# EAGLE design Flasher_LED_Board (EAGLE 9.6.0)
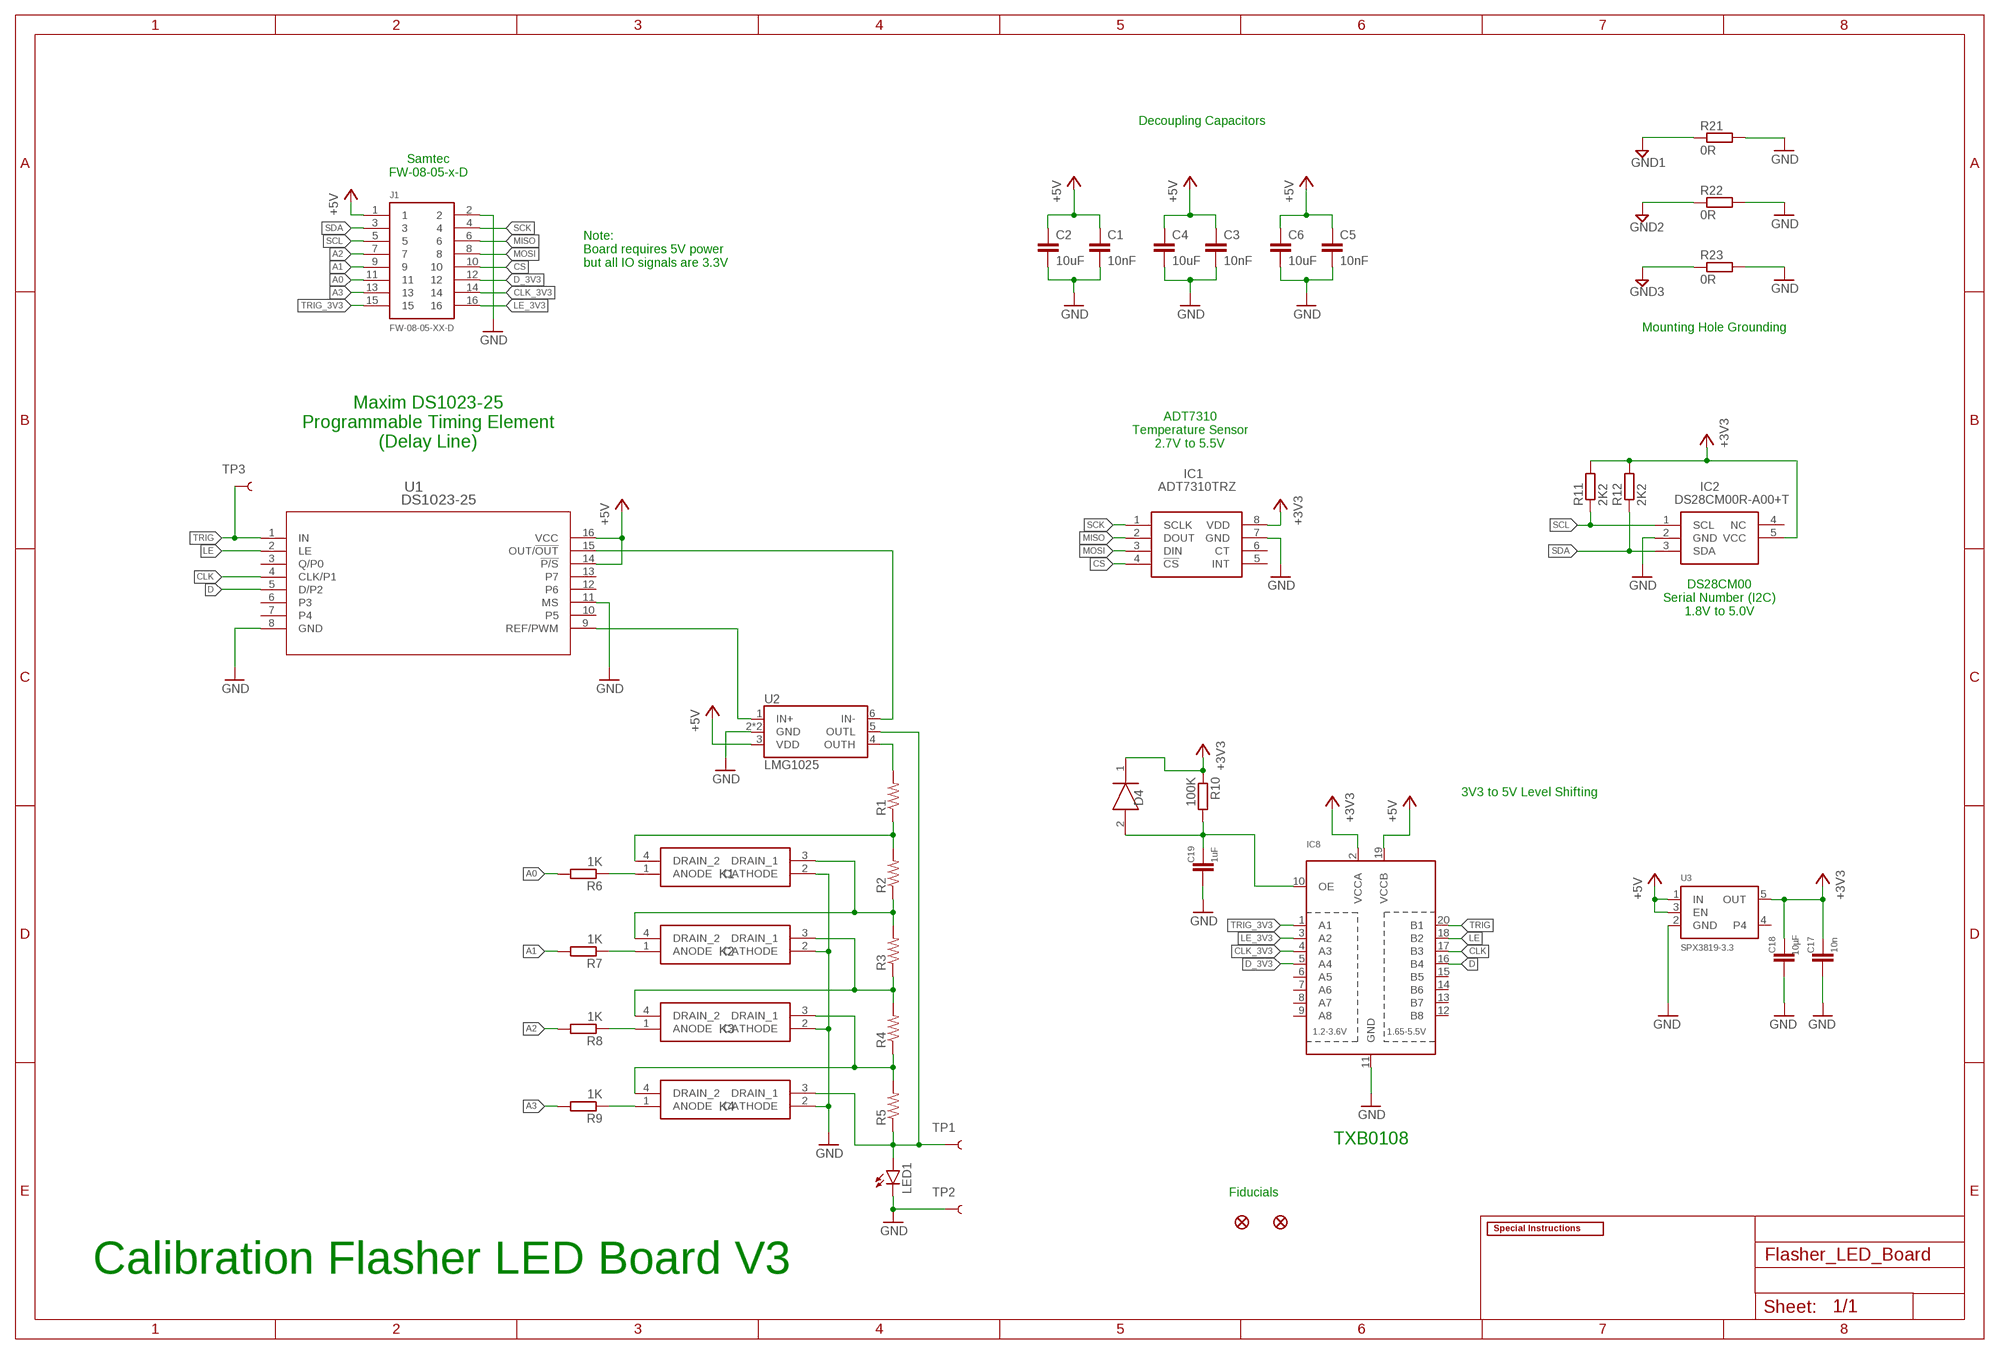
[diagram p0: schematic, sheet 1]

## Parts
C1  10nF  C-EUC0805  [C0805]
C2  10uF  C-EUC0805  [C0805]
C3  10nF  C-EUC0805  [C0805]
C4  10uF  C-EUC0805  [C0805]
C5  10nF  C-EUC0805  [C0805]
C6  10uF  C-EUC0805  [C0805]
C17  10n  C-EUC0603  [C0603]
C18  10µF  C-EUC0805  [C0805]
C19  1uF  C-EUC0603  [C0603]
D4  CD0603-B00340  [DIOM179X85N]
FD1  FIDUCIAL1X2  [FIDUCIAL-1X2]
FD2  FIDUCIAL1X2  [FIDUCIAL-1X2]
IC1  ADT7310TRZ  [SOIC127P600X175-8N]
IC2  DS28CM00R-A00+T  [SOT95P280X145-5N]
IC8  TXB0108PWR  [TSSOP20]
J1  FW-08-05-XX-D  [FW-08-05-XX-D]
K1  TLP3475R(TP,F  [TLP3475RTPF]
K2  TLP3475R(TP,F  [TLP3475RTPF]
K3  TLP3475R(TP,F  [TLP3475RTPF]
K4  TLP3475R(TP,F  [TLP3475RTPF]
LED1  LED3MM  [LED3MM]
LOGO6  SPECIAL_INSTRUCTIONS-ORDERING  [ORDERING_INSTRUCTIONS]
R1  RESISTOR0805-RES  [0805]
R2  RESISTOR0805-RES  [0805]
R3  RESISTOR0805-RES  [0805]
R4  RESISTOR0805-RES  [0805]
R5  RESISTOR0805-RES  [0805]
R6  1K  R-EU_R0603  [R0603]
R7  1K  R-EU_R0603  [R0603]
R8  1K  R-EU_R0603  [R0603]
R9  1K  R-EU_R0603  [R0603]
R10  100K  R-EU_R0603  [R0603]
R11  2K2  R-EU_R0603  [R0603]
R12  2K2  R-EU_R0603  [R0603]
R21  0R  R-EU_R0603  [R0603]
R22  0R  R-EU_R0603  [R0603]
R23  0R  R-EU_R0603  [R0603]
TP1  TEST-POINTPOGO_PTH  [1X01_NO_SILK]
TP2  TEST-POINTPOGO_PTH  [1X01_NO_SILK]
TP3  TEST-POINTPOGO_PTH  [1X01_NO_SILK]
U1  DS1023-25  [21-0042B_16]
U2  LMG1025  [LMG1025]
U3  SPX3819-3.3  VREG_SOT23-5  [SOT23-5]

## Nets
+3V3: C17.1 C18.1 D4.1(K) IC1.8(VDD) IC2.5(VCC) IC8.2(VCCA) R10.1 R11.2 R12.2 U3.5(OUT)
+5V: C1.1 C2.1 C3.1 C4.1 C5.1 C6.1 IC8.19(VCCB) J1.1 U1.14(!P/S) U1.16(VCC) U2.3(VDD) U3.1(IN) U3.3(EN)
A0: J1.11 R6.2
A1: J1.9 R7.2
A2: J1.7 R8.2
A3: J1.13 R9.2
CLK: IC8.17(B3) U1.4(CLK/P1)
CLK_3V3: IC8.4(A3) J1.14
CS: IC1.4(!CS) J1.10
D: IC8.16(B4) U1.5(D/P2)
D_3V3: IC8.5(A4) J1.12
GND: C1.2 C2.2 C3.2 C4.2 C5.2 C6.2 C17.2 C18.2 C19.2 IC1.7(GND) IC2.2(GND) IC8.11(GND) J1.2 K1.2(CATHODE) K2.2(CATHODE) K3.2(CATHODE) K4.2(CATHODE) LED1.K(C) R21.2 R22.2 R23.2 TP2.1 U1.8(GND) U1.11(MS) U2.2(GND) U2.PAD(GND) U3.2(GND)
GND1: R21.1
GND2: R22.1
GND3: R23.1
LE: IC8.18(B2) U1.2(LE)
LE_3V3: IC8.3(A2) J1.16
MISO: IC1.2(DOUT) J1.6
MOSI: IC1.3(DIN) J1.8
N$9: C19.1 D4.2(A) IC8.10(OE) R10.2
N$33: U1.15(OUT/!OUT) U2.6(IN-)
N$34: U1.9(REF/PWM) U2.1(IN+)
N$35: R1.2 U2.4(OUTH)
N$36: K1.4(DRAIN_2) R1.1 R2.2
N$37: K1.3(DRAIN_1) K2.4(DRAIN_2) R2.1 R3.2
N$38: K2.3(DRAIN_1) K3.4(DRAIN_2) R3.1 R4.2
N$39: K3.3(DRAIN_1) K4.4(DRAIN_2) R4.1 R5.2
N$40: K4.3(DRAIN_1) LED1.A R5.1 TP1.1 U2.5(OUTL)
N$41: K1.1(ANODE) R6.1
N$42: K2.1(ANODE) R7.1
N$43: K3.1(ANODE) R8.1
N$44: K4.1(ANODE) R9.1
SCK: IC1.1(SCLK) J1.4
SCL: IC2.1(SCL) J1.5 R11.1
SDA: IC2.3(SDA) J1.3 R12.1
TRIG: IC8.20(B1) TP3.1 U1.1(IN)
TRIG_3V3: IC8.1(A1) J1.15
Unconnected: IC1.5(INT) IC1.6(CT) IC2.4(NC) IC8.6(A5) IC8.7(A6) IC8.8(A7) IC8.9(A8) IC8.12(B8) IC8.13(B7) IC8.14(B6) IC8.15(B5) U1.3(Q/P0) U1.6(P3) U1.7(P4) U1.10(P5) U1.12(P6) U1.13(P7) U3.4

## Notes on the sheet
- Decoupling Capacitors
- Samtec
  FW-08-05-x-D
- Note:
  Board requires 5V power
  but all IO signals are 3.3V
- Mounting Hole Grounding
- Maxim DS1023-25
  Programmable Timing Element
  (Delay Line)
- ADT7310
  Temperature Sensor
  2.7V to 5.5V
- DS28CM00
  Serial Number (I2C)
  1.8V to 5.0V
- 3V3 to 5V Level Shifting
- TXB0108
- Fiducials
- Calibration Flasher LED Board V3

## Library data of the parts
C1-C6 C17-C19 = rcl:C-EU: CAPACITOR, European symbol; SPICEPREFIX: C
D4 = SamacSys_Parts:CD0603-B00340: Diode Schottky Signal 45V 30mA 0603 Bourns CD0603-B00340, SMT Schottky Diode, 45V 30mA, 2-Pin 0603 Source: Datasheet <https://www.arrow.com/en/products/cd0603-b00340/bourns>; ARROW_PART_NUMBER: CD0603-B00340; DESCRIPTION: Diode Schottky Signal 45V 30mA 0603 Bourns CD0603-B00340, SMT Schottky Diode, 45V 30mA, 2-Pin 0603; HEIGHT: 0.85mm; MANUFACTURER_NAME: Bourns; MANUFACTURER_PART_NUMBER: CD0603-B00340
FD1 FD2 = SparkFun-Aesthetics:FIDUCIAL: Fiducial Alignment Points Various fiducial points for machine vision alignment.
IC1 = SamacSys_Parts:ADT7310TRZ: ADT7310TRZ, 16 bit Temperature Sensor 0.5C Serial-SPI 2.7 3.6 V 8-Pin SOIC Source: Datasheet <http://docs-emea.rs-online.com/webdocs/12a1/0900766b812a177b.pdf>; ARROW_PART_NUMBER: ADT7310TRZ; ARROW_PRICE-STOCK: https://www.arrow.com/en/products/adt7310trz/analog-devices; DESCRIPTION: ADT7310TRZ, 16 bit Temperature Sensor 0.5C Serial-SPI 2.7 3.6 V 8-Pin SOIC; HEIGHT: 1.75mm; MANUFACTURER_NAME: Analog Devices; MANUFACTURER_PART_NUMBER: ADT7310TRZ; RS_PART_NUMBER: 7969022P; RS_PRICE-STOCK: http://uk.rs-online.com/web/p/products/7969022P
IC2 = SamacSys_Parts:DS28CM00R-A00+T: Maxim DS28CM00R-A00+T, Silicon Serial Number 48bit Surface Mount, 1.62 5.25 V, 5-Pin SOT-23 Source: Datasheet <https://componentsearchengine.com/Datasheets/1/DS28CM00R-A00 T.pdf>; DESCRIPTION: Maxim DS28CM00R-A00+T, Silicon Serial Number 48bit Surface Mount, 1.62 5.25 V, 5-Pin SOT-23; HEIGHT: 1.45mm; MANUFACTURER_NAME: Maxim Integrated; MANUFACTURER_PART_NUMBER: DS28CM00R-A00+T; MOUSER_PART_NUMBER: 700-DS28CM00R-A00T
IC8 = adafruit:TXB0108PWR: 8-Bit Bi-Directional Level Shifter 1.2V-3.6V (VCCA) to 1.65V-5.5V (VCCB) bi-directional level shifter with auto direction sensing. Max data rate - VCCA 1.8V: 20Mbps (50ns), VCCA 3.3V: 100Mbps (10ns) Digikey: 296-21527-1-ND
J1 = FW-08-05-XX-D:FW-08-05-XX-D: .050 x .050 SURFACE MOUNT BOARD SPACERS.
K1-K4 = SamacSys_Parts:TLP3475R(TP,F: Solid State Relays - PCB Mount Photo-IC 3mA 50V 5000Vrms Source: Datasheet <http://toshiba.semicon-storage.com/info/docget.jsp?did=55304&prodName=TLP3475R>; DESCRIPTION: Solid State Relays - PCB Mount Photo-IC 3mA 50V 5000Vrms; HEIGHT: 1mm; MANUFACTURER_NAME: Toshiba; MANUFACTURER_PART_NUMBER: TLP3475R(TP,F; MOUSER_PART_NUMBER: 757-TLP3475RTPF; MOUSER_PRICE-STOCK: https://www.mouser.com/Search/Refine.aspx?Keyword=757-TLP3475RTPF
LED1 = SparkFun-LED:LED: LEDs Standard schematic elements and footprints for 5mm, 3mm, 1206, and 0603 sized LEDs. 5mm - Spark Fun Electronics SKU : COM-00529 (and others); PROD_ID: DIO-08794
LOGO6 = SparkFun-Aesthetics:SPECIAL_INSTRUCTIONS: Special Ordering/Production Instructions Alert Symbol for special PCB ordering instructions or unique production process warnings. Ordering Instructions Production Instructions Types of information that should be added to box: Copper weight Soldermask color Silk color PCB thickness Number of layers PCB Standard: 1.6mm FR4 1 oz copper immersion silver plating red soldermask white silkscreen Types of information that should be added to box: Special wash requirements Depaneling instructions Humidification Glue curing Default text settings: 0.07 inch 9% ratio 50% line distance
R1-R5 = SparkFun-Resistors:RESISTOR: Resistor Basic schematic elements and footprints for 0603, 1206, and PTH resistors.
R6-R9 = resistor:R-EU_: RESISTOR, European symbol
R10-R12 R21-R23 = rcl:R-EU_: RESISTOR, European symbol; SPICEPREFIX: R
TP1-TP3 = SparkFun-Connectors:TEST-POINT: SparkFun Test Points Bare copper test points for troubleshooting or In-Circuit-Testing. These are used by our Production team for verifying production board runs using pogo-pins on test beds. SparkFun Products: SparkFun LSM9DS1 Breakout <https://www.sparkfun.com/products/13284> SparkFun PSOC <https://www.sparkfun.com/products/13714> SparkFun Load Cell Amplifier <https://www.sparkfun.com/products/13879>
U1 = DS1023:DS1023-25; MANUFACTURER_PART_NUMBER: DS102325; VENDOR: MAXIM
U2 = LMG1025:LMG1025: Texas Instruments LMG1025-Q1 Automotive Low Side GaN and MOSFET Driver For High Frequency and Narrow Pulse Applications
U3 = microbuilder:VREG_SOT23-5: SOT23-5 Fixed Voltage Regulators Part Current Out V Out V In V Dropout θJA (°C/W) TJ (°C) Digikey Part No. ADP121 150mA 3.3V 3.4-5.5V 0.09V @ 150mA -- -- ADP121-AUJZ33R7CT-ND ADP121 150mA 3.0V 3.1-5.5V 0.09V @ 150mA -- -- ADP121-AUJZ30R7CT-ND ADP122 300mA 3.3V 3.4-5.5V 0.085V @ 300mA -- -- ADP122AUJZ-3.3-R7CT-ND ADP1712 300mA 3.3V 3.5-5.5V 0.17V @ 300mA -- -- ADP1712AUJZ-3.3-R7TR-ND AP7311 (Low Cost) 150mA 3.3V 3.5-6V 0.15V @ 150mA -- -- AP7311-33WG-7DICT-ND LD39015M18R 150mA 1.8V 1.9V-5.5V 0.08V @ 100mA -- -- 497-6977-1-ND LP2985A-33DBVR 150mA 3.3V 3.3-16V 0.28V @ 150mA 206 150 296-18479-1-ND MCP1824T-3302E/OT 300mA 3.3V 3.5V-6V 0.2V @ 300mA -- -- MCP1824T-3302E/OTCT-ND MIC5205-2.5YM5 TR 150mA 2.5V 2.7-16V 0.165V @ 150mA -- -- 576-1257-2-ND MIC5205-3.0YM5 TR 150mA 3.0V 3.2V-16V 0.165V @ 150mA -- -- 576-1258-2-ND MIC5205-3.3YM5 TR 150mA 3.3V 3.5V-16V 0.165V @ 150mA -- -- 576-1259-2-ND TPS780330220 150mA 3.3V+2.2V 3.6-5.5V 250mV Max -- -- 296-23332-1-ND TDA3663/N1,135 100mA 3.3V 3.5-45V 0.18V @ 50mA -- -- 568-5343-1-ND Max operating temp can be calculated using θJA, TJ (max junction temperature), and power in watts. Set the "Maximum Ambient Temperature" until it reaches TJ ("Max Junction Temperature"), which is the absolute limit for safe use of the regulator: Heat Sink Temperature Calculator <http://www.daycounter.com/Calculators/Heat-Sink-Temperature-Calculator.phtml> For example, With 12V source into a 3.3V LP2985 and a 30mA load, we are dissipating (12V-3.3V) * 0.03A = 0.261W. With a θJA of 206 °C/W, a TJ of 150°C, and 261mW we can safely use the chip without a heat sink up to 75°C (=147.1°C Junction Temperature).

## Board
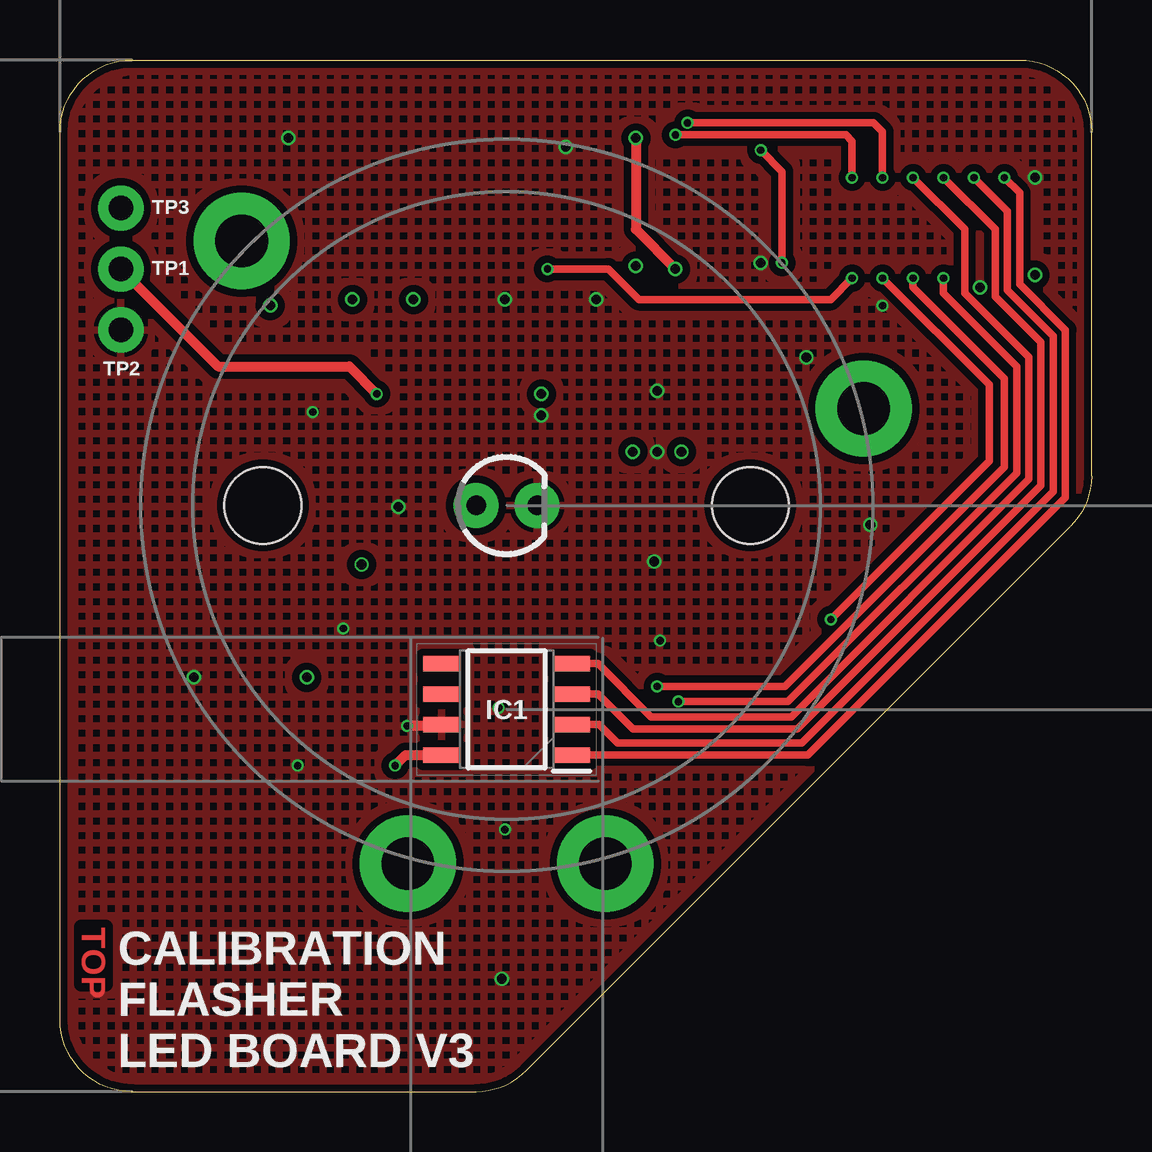
[diagram p1: board, top side]
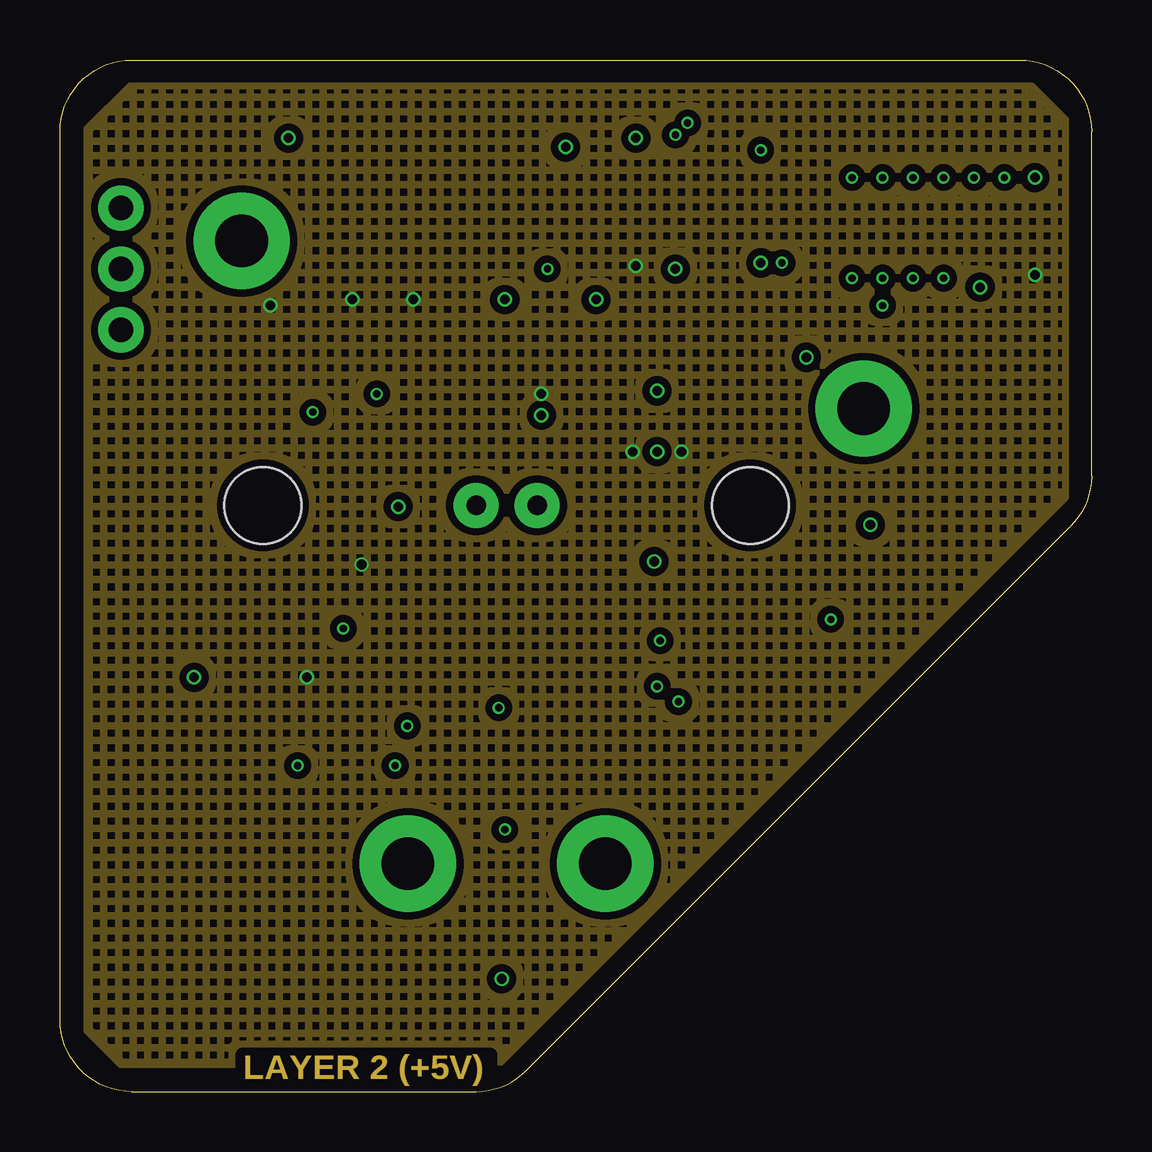
[diagram p2: board, inner layer Route2]
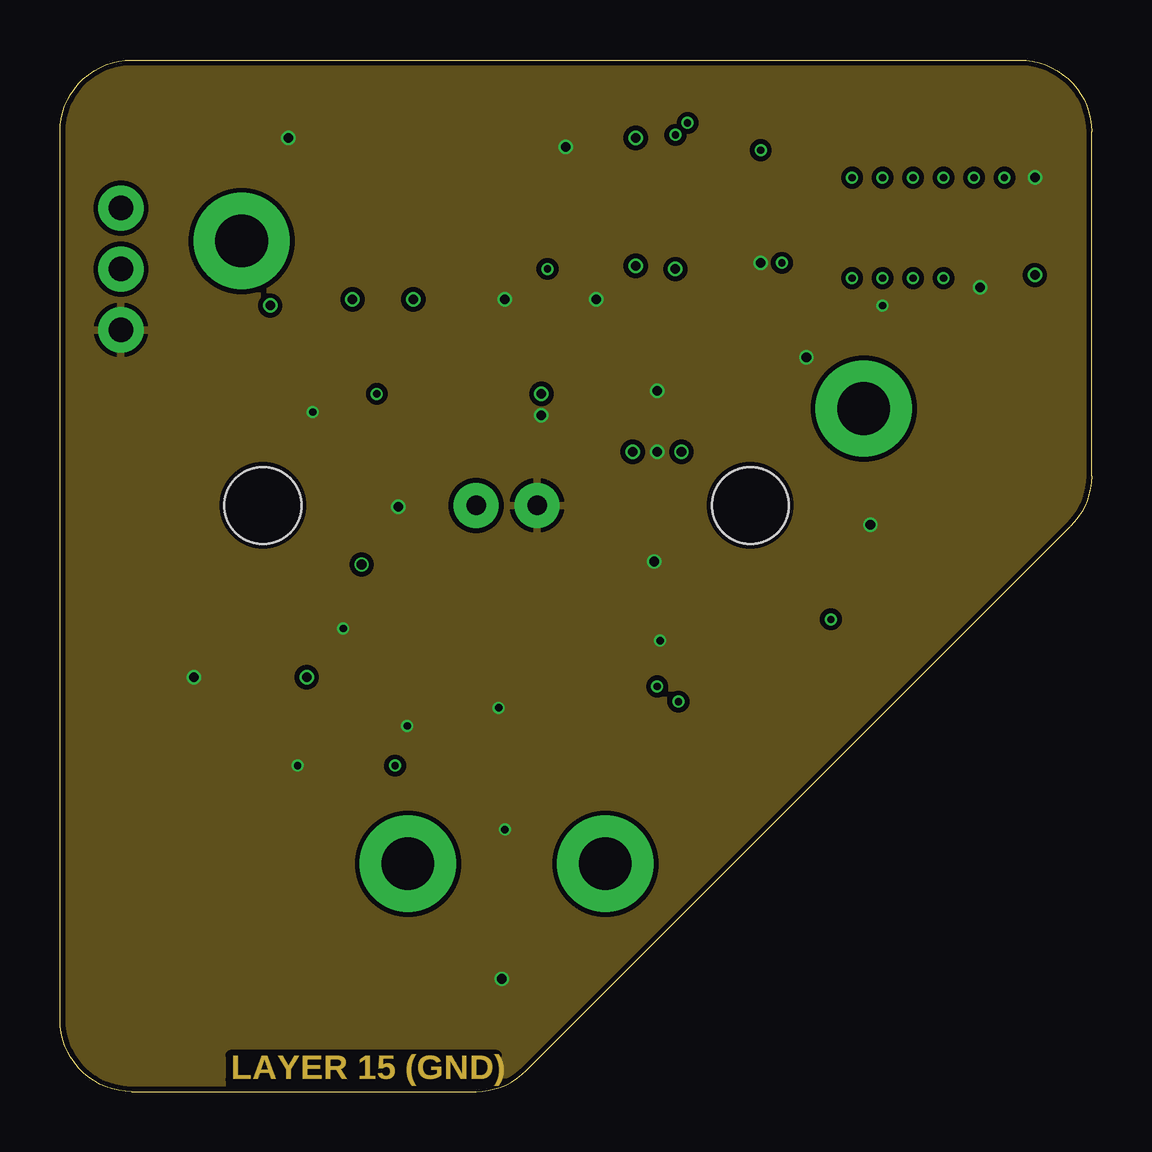
[diagram p3: board, inner layer Route15]
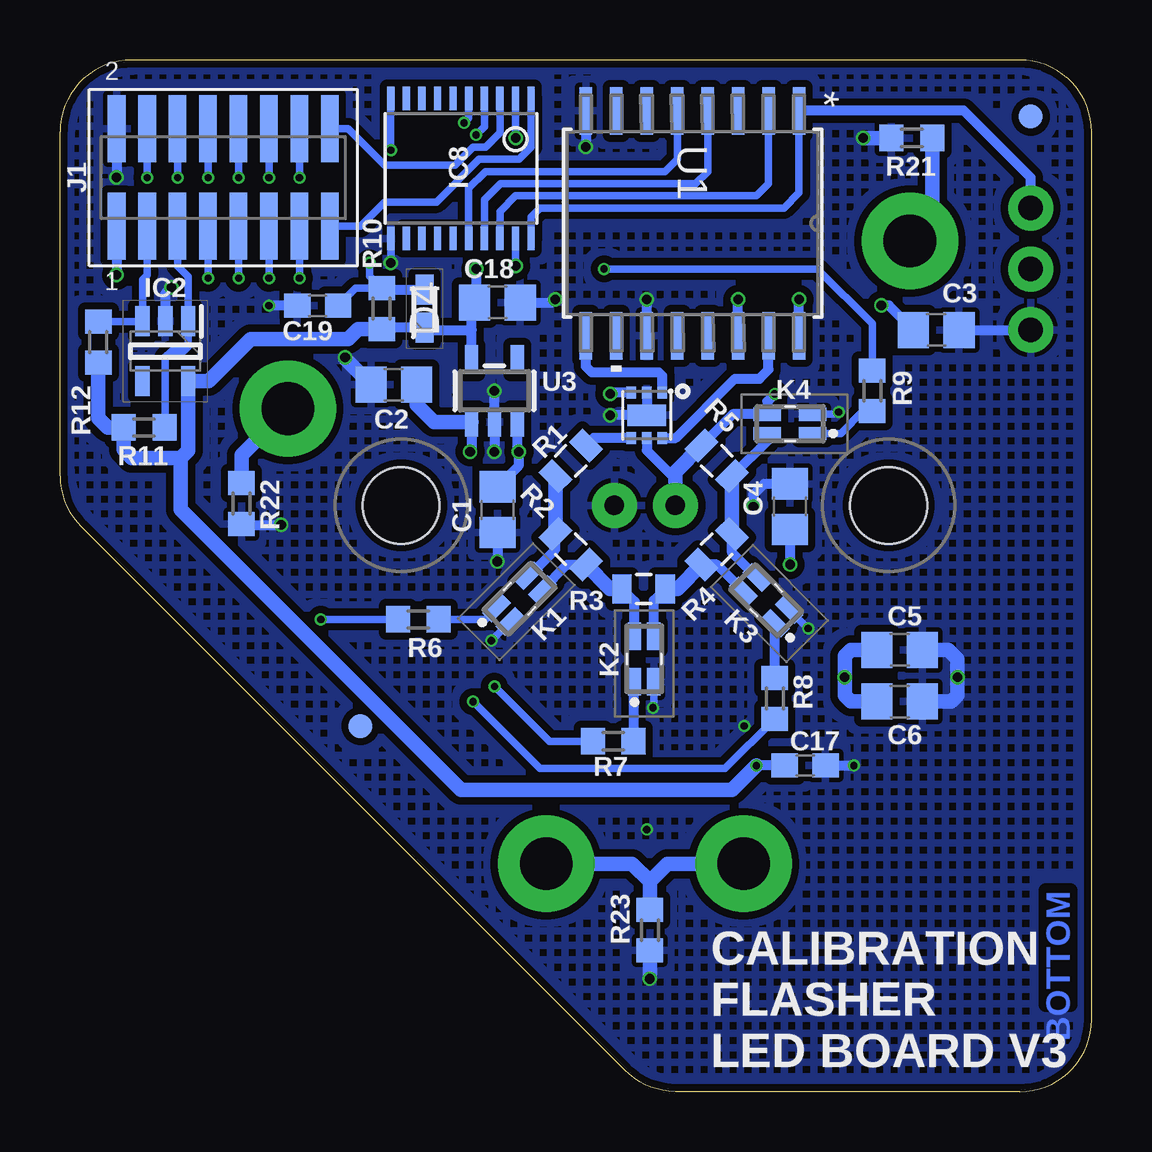
[diagram p4: board, bottom side, seen from below]

Size 43 x 43 mm. Coordinates in mm from the lower left corner, seen from the top.
Outline: 0,3 0,40.01 arc-90 3,43 40.01,43 arc-90 43,40.01 43,25.65 arc-45 42.11,23.55 19.46,0.89 arc-45 17.35,0 3,0 arc-90 0,3
Copper layers (1+2*15+16): Top 0.018mm / dielectric 0.36mm / Route2 0.035mm / dielectric 0.71mm / Route15 0.035mm / dielectric 0.2mm / Bottom 0.018mm
Design rules "Multi-CB_4L_100µm-Tracks_OL35µm-IL35µm *": minimum track width 0.1mm, minimum drill 0.2mm, track to track 0.1mm, track to pad 0.1mm, pad to pad 0.1mm, via to via 0.1mm, smd to smd 0mil, copper to edge 0.2mm, drill to drill 0.2mm, minimum pad ring 0.125mm, minimum via ring 0.1mm, stop-mask expansion 2mil, vias tented up to drill 0.45mm, thermal gap 0.2mm
Holes 3.2 mm at 8.46,24.43 28.78,24.43

### Footprints (pad centres in the part's own frame; a part is rotated, then mirrored left to right if it is on the bottom)
C0805 = smd 1.3 x 1.5: 1 -0.95,0; 2 0.95,0
C0603 = smd 1.1 x 1: 1 -0.85,0; 2 0.85,0
DIOM179X85N = smd 1.25 x 0.75: 1 -0.8,0; 2 0.8,0
FIDUCIAL-1X2 = smd 1 x 1: 1 0,0
SOIC127P600X175-8N = smd 1.525 x 0.65: 1 -2.712,1.905; 2 -2.712,0.635; 3 -2.712,-0.635; 4 -2.712,-1.905; 5 2.712,-1.905; 6 2.712,-0.635; 7 2.712,0.635; 8 2.712,1.905
SOT95P280X145-5N = smd 1.25 x 0.6: 1 -1.25,0.95; 2 -1.25,0; 3 -1.25,-0.95; 4 1.25,-0.95; 5 1.25,0.95
TSSOP20 = smd 0.305 x 0.991: 1 -2.925,-2.918; 2 -2.275,-2.918; 3 -1.625,-2.918; 4 -0.975,-2.918; 5 -0.325,-2.918; 6 0.325,-2.918; 7 0.975,-2.918; 8 1.625,-2.918; 9 2.275,-2.918; 10 2.925,-2.918; 11 2.925,2.918; 12 2.275,2.918; 13 1.625,2.918; 14 0.975,2.918; 15 0.325,2.918; 16 -0.325,2.918; 17 -0.975,2.918; 18 -1.625,2.918; 19 -2.275,2.918; 20 -2.925,2.918
FW-08-05-XX-D = smd 0.737 x 2.794: 1 -4.445,-2.032; 2 -4.445,2.032; 3 -3.175,-2.032; 4 -3.175,2.032; 5 -1.905,-2.032; 6 -1.905,2.032; 7 -0.635,-2.032; 8 -0.635,2.032; 9 0.635,-2.032; 10 0.635,2.032; 11 1.905,-2.032; 12 1.905,2.032; 13 3.175,-2.032; 14 3.175,2.032; 15 4.445,-2.032; 16 4.445,2.032
TLP3475RTPF = smd 0.55 x 1.15: 1 0,-0.95; 2 0.8,-0.95; 3 0.8,0.95; 4 0,0.95
LED3MM = drill 0.813 pad 1.88: A -1.27,0; K 1.27,0
0805 = smd 0.8 x 1.2: 1 -0.9,0; 2 0.9,0
R0603 = smd 1 x 1.1: 1 -0.85,0; 2 0.85,0
1X01_NO_SILK = drill 1.016 pad 1.88: 1 0,0
21-0042B_16 = smd 1.981 x 0.533: 1 -4.686,4.445; 2 -4.686,3.175; 3 -4.686,1.905; 4 -4.686,0.635; 5 -4.686,-0.635; 6 -4.686,-1.905; 7 -4.686,-3.175; 8 -4.686,-4.445; 9 4.686,-4.445; 10 4.686,-3.175; 11 4.686,-1.905; 12 4.686,-0.635; 13 4.686,0.635; 14 4.686,1.905; 15 4.686,3.175; 16 4.686,4.445
LMG1025 = smd 0.4 x 0.5: 1 -0.65,-0.95; 2 0,-0.95; 3 0.65,-0.95; 4 0.65,0.95; 5 0,0.95; 6 -0.65,0.95 | smd 1.6 x 0.9: PAD 0,0
SOT23-5 = smd 0.55 x 1.2: 1 -0.95,-1.3; 2 0,-1.3; 3 0.95,-1.3; 4 0.95,1.3; 5 -0.95,1.3

### Placement (x,y rotation side)
C1  24.77,24.26 270 bottom
C2  29.08,29.46 180 bottom
C3  6.48,31.75 0 bottom
C4  12.57,24.38 90 bottom
C5  8,18.41 0 bottom
C6  8,16.26 0 bottom
C17  11.94,13.59 0 bottom
C18  24.77,32.89 0 bottom
C19  32.26,32.77 180 bottom
D4  27.81,32.64 90 bottom
FD1  2.54,40.64 0 bottom
FD2  30.48,15.24 0 bottom
IC1  18.62,15.94 180 top
IC2  38.61,30.86 270 bottom
IC8  26.29,38.48 180 bottom
J1  36.2,38.1 0 bottom
K1  24.13,20.83 315 bottom
K2  19.05,18.03 0 bottom
K3  13.84,20.19 45 bottom
K4  12.57,27.43 90 bottom
LED1  18.62,24.43 0 top
LOGO6  -8.89,-7.62 0 top  (outside the outline)
R1  21.72,26.29 45 bottom
R2  21.72,22.61 135 bottom
R3  18.67,20.95 180 bottom
R4  15.62,22.61 225 bottom
R5  15.62,26.29 315 bottom
R6  28.07,19.68 180 bottom
R7  19.94,14.61 180 bottom
R8  13.21,16.38 270 bottom
R9  9.14,29.21 90 bottom
R10  29.59,32.64 90 bottom
R11  39.5,27.69 180 bottom
R12  41.4,31.24 270 bottom
R21  7.49,39.75 180 bottom
R22  35.43,24.51 270 bottom
R23  18.41,6.73 270 bottom
TP1  2.54,34.29 0 top
TP2  2.54,31.75 0 top
TP3  2.54,36.83 0 top
U1  16.64,36.2 270 bottom
U2  18.54,28.19 180 bottom
U3  24.89,29.21 0 bottom

### Tracks (layer width: path | path; a pad name or v marks a point on that pad's centre or on a via)
+3V3  (via drill 0.3, 0.4)
  Top 0.406: v13.97,13.59 14.41,14.03 IC1.8 | v24,39.75 24,35.94 v25.65,34.29
  Bottom 0.305: IC8.2 24.01,39.76 v24,39.75 | 25.65,32.95 C18.1
  Bottom 0.406: C17.1 v13.97,13.59 | U3.5 25.84,31.75 | 25.84,31.75 25.84,32.77 C18.1 | 25.84,31.75 27.72,31.75 D4.1 29.54,31.84 R10.1 | v25.65,34.29 25.65,32.95
  Bottom 0.61: R10.1 30.57,31.79 30.99,31.37 35.05,31.37 36.81,29.61 IC2.5 37.66,26.73 37.97,26.42 | R12.2 41.4,28.07 41.02,27.69 R11.2 40.35,26.76 40.01,26.42 37.97,26.42 | v13.97,13.59 14.99,12.57 26.29,12.57 37.97,24.26 37.97,26.42
+5V  (via drill 0.4)
  Bottom 0.305: IC8.19 24.01,34.43 v24,34.42
  Bottom 0.406: U1.14 v14.73,33.02 | U1.16 v12.19,33.02 | U2.3 20,29.14 v20.07,29.08 | J1.1 v40.64,34.04 | U3.3 23.94,26.74 v23.88,26.67 23.88,26.1 C1.1 | U3.1 25.84,26.74 v25.91,26.67 | C4.1 v12.57,21.97 | C3.1 8.44,32.77 v8.76,32.77
  Bottom 0.61: C2.1 28.13,28.64 27.4,27.91 U3.1 | C6.1 10.03,16.26 10.29,16.51 v10.29,17.27 10.29,18.16 10.03,18.41 C5.1
  pour Route2 (isolate 0.305, hatched): 1.14,2.54 2.54,1.14 18.29,1.14 41.91,24.77 41.91,40.51 40.51,41.91 2.92,41.91 1.14,40.13
A0  (via drill 0.3)
  Top 0.305: v32.13,19.68 38.73,26.29 38.73,29.46 v34.29,33.91
  Bottom 0.305: J1.11 v34.29,33.91 | R6.2 v32.13,19.68
A1  (via drill 0.3)
  Top 0.305: v24.89,16.89 30.23,16.89 39.37,26.04 39.37,29.72 35.56,33.53 v35.56,33.91
  Bottom 0.305: R7.2 22.61,14.61 v24.89,16.89 | J1.9 v35.56,33.91
A2  (via drill 0.3)
  Top 0.305: v25.78,16.26 30.35,16.26 39.88,25.78 39.88,30.23 36.83,33.27 v36.83,33.91
  Bottom 0.305: J1.7 v36.83,33.91 | R8.2 15.28,13.46 22.99,13.46 v25.78,16.26
A3  (via drill 0.3)
  Top 0.305: v20.32,34.29 22.86,34.29 24.13,33.02 32.13,33.02 v33.02,33.91
  Bottom 0.305: J1.13 v33.02,33.91 | R9.2 9.14,32 11.43,34.29 v20.32,34.29
CLK
  Bottom 0.305: U1.4 16,38.35 16.51,37.85 24.64,37.85 25.31,37.17 IC8.17
CLK_3V3  (via drill 0.3)
  Top 0.305: v25.65,39.88 32.77,39.88 33.02,39.62 v33.02,38.1
  Bottom 0.305: IC8.4 25.31,40.22 v25.65,39.88 | v33.02,38.1 J1.14
CS  (via drill 0.3)
  Top 0.305: IC1.4 22.42,17.84 24.64,15.62 30.48,15.62 40.39,25.53 40.39,30.61 37.72,33.27 37.72,35.94 v35.56,38.1
  Bottom 0.305: J1.10 v35.56,38.1
D
  Bottom 0.305: U1.5 17.27,38.86 17.78,38.35 25.27,38.35 25.96,37.66 IC8.16
D_3V3  (via drill 0.3)
  Top 0.305: v26.16,40.38 33.91,40.38 34.29,40.01 v34.29,38.1
  Bottom 0.305: IC8.5 25.96,40.58 v26.16,40.38 | v34.29,38.1 J1.12
GND  (via drill 0.3, 0.4)
  Top 0.406: IC1.7 15.85,15.24 v14.48,15.24
  Bottom 0.305: K1.2 v25.02,18.81 v25.02,18.8 | K2.2 18.25,16.04 v18.29,16 | K3.2 11.82,19.3 v11.81,19.3 | K4.2 10.63,28.23 v10.54,28.32 | IC8.11 v29.21,34.54
  Bottom 0.406: U1.11 v18.54,33.02 | v20.07,28.19 U2.PAD U2.2 | U1.8 v21.08,39.37 | J1.2 v40.64,38.1 | v38.35,33.53 38.61,33.27 IC2.2 | R22.2 35.39,23.62 v33.78,23.62 | C19.2 v34.29,32.77 | C17.2 v9.91,13.59 | v24.89,29.21 U3.2 v24.89,26.67 | C18.2 22.48,32.89 v22.35,33.02 | C1.2 v24.77,22.1 | C4.2 13.65,25.33 14.1,24.89 v14.1,24.38 | C3.2 TP2.1
  Bottom 0.61: v18.41,4.7 R23.2 | R21.2 v9.53,39.75 | C2.2 31.11,30.55 v31.11,30.61 | C5.2 5.97,18.41 5.59,18.03 v5.59,17.27 5.59,16.51 5.84,16.26 C6.2
  other vias: 18.54,10.92
  pour Route15 (isolate 0.203): 0,0 0,43 43,43 43,0
  pour Top (isolate 0.305, hatched): 0,0 0,43 43,43 43,0
  pour Bottom (isolate 0.305, hatched): 0,0 0,43 43,43 43,0
GND1  (via drill 2.2 pad 4.01)
  Bottom 0.61: R21.1 6.64,36.38 v7.57,35.46
GND2  (via drill 2.2 pad 4.01)
  Bottom 0.61: v33.5,28.47 35.43,26.54 R22.1
GND3  (via drill 2.2 pad 4.01)
  Bottom 0.61: R23.1 18.41,8.76 | 18.41,8.76 17.68,9.5 v14.5,9.5 | v22.73,9.5 19.15,9.5 18.41,8.76
LE
  Bottom 0.305: U1.2 13.46,37.85 13.97,37.34 24,37.34 24.66,36.68 IC8.18
LE_3V3
  Bottom 0.305: IC8.3 24.66,39.98 25.27,39.37 25.78,39.37 26.54,38.61 29.46,38.61 30.99,40.13 J1.16
MISO  (via drill 0.3)
  Top 0.305: IC1.2 22.47,15.3 23.23,14.54 30.92,14.54 41.4,25.02 41.4,31.5 39.5,33.4 39.5,36.7 v38.1,38.1
  Bottom 0.305: J1.6 v38.1,38.1
MOSI  (via drill 0.3)
  Top 0.305: IC1.3 22.42,16.57 23.88,15.11 30.73,15.11 40.89,25.27 40.89,31.24 38.99,33.15 38.99,35.94 v36.83,38.1
  Bottom 0.305: J1.8 v36.83,38.1
N$9  (via drill 0.3)
  Top 0.305: v29.21,39.24 30.1,38.35 v30.1,34.54
  Bottom 0.305: IC8.10 v29.21,39.25 v29.21,39.24 | v30.1,34.54 30.1,34 R10.2 30.68,33.49 C19.1
  Bottom 0.406: R10.2 29.54,33.44 D4.2
N$33
  Bottom 0.406: U2.6 17.33,27.24 14.86,29.72 13.84,29.72 13.46,30.1 U1.15
N$34
  Bottom 0.406: U2.1 17.89,29.83 18.03,29.97 20.83,29.97 21.08,30.23 U1.9
N$35
  Bottom 0.406: U2.4 20.76,27.24 R1.2
N$36
  Bottom 0.406: K1.4 22.35,22.61 R2.2
  Bottom 0.61: R2.2 R1.1
N$37
  Bottom 0.406: K2.4 19.05,20.44 R3.2 | K1.3 21.86,21.97 R2.1
  Bottom 0.61: R2.1 20.07,20.95 R3.2
N$38
  Bottom 0.406: K3.4 15.62,21.97 R4.2 | K2.3 18.25,20.47 R3.1
  Bottom 0.61: R4.2 17.27,20.95 R3.1
N$39
  Bottom 0.406: K3.3 14.98,22.47 R4.1 | K4.4 13.52,27.11 R5.2
  Bottom 0.61: R5.2 R4.1
N$40  (via drill 0.3)
  Top 0.406: TP1.1 6.6,30.23 12.06,30.23 v13.21,29.08
  Bottom 0.406: U2.5 18.54,26.72 17.35,25.53 | R5.1 14.95,28.23 K4.3 13.52,28.77 v13.21,29.08
  Bottom 0.61: R5.1 17.35,25.84 17.35,25.53 LED1.A
N$41
  Bottom 0.305: R6.1 25.27,19.68 K1.1
N$42
  Bottom 0.406: K2.1 19.09,17.05 R7.1
N$43
  Bottom 0.406: R8.1 13.21,19.48 K3.1
N$44
  Bottom 0.305: K4.1 10.45,27.43 9.53,28.36 R9.1
SCK  (via drill 0.3)
  Top 0.305: IC1.1 31.18,14.03 41.91,24.77 41.91,31.75 40.01,33.66 40.01,37.47 v39.37,38.1
  Bottom 0.305: J1.4 v39.37,38.1
SCL
  Bottom 0.305: J1.5 38.1,34.42 37.66,33.98 IC2.1 37.66,31.05 37.85,30.86 38.35,30.86 38.61,30.61 38.61,27.73 R11.1
SDA
  Bottom 0.305: J1.3 39.37,34.04 39.56,33.85 IC2.3 39.58,32.09 R12.1
TRIG
  Bottom 0.305: U1.1 12.19,37.47 12.83,36.83 22.99,36.83 23.36,36.45 IC8.20
  Bottom 0.406: TP3.1 2.54,38.1 5.33,40.89 12.18,40.89 U1.1
TRIG_3V3
  Bottom 0.305: IC8.1 23.36,39.37 23.88,38.86 25.53,38.86 27.3,37.08 29.46,37.08 30.48,36.07 J1.15

### Text on the board
Top: TOP
Route2: LAYER 2 (+5V)
Route15: LAYER 15 (GND)
Bottom: BOTTOM
tPlace: CALIBRATION / FLASHER / LED BOARD V3
bPlace: CALIBRATION / FLASHER / LED BOARD V3
Document: 3.2mm holes are for a ThorLabs / S1LEDM SM1-Threaded Mount
tDocu: 4-layer board | 1.6mm thickness | ENIG finish